# EAGLE design scoreboard (EAGLE 9.6.2)
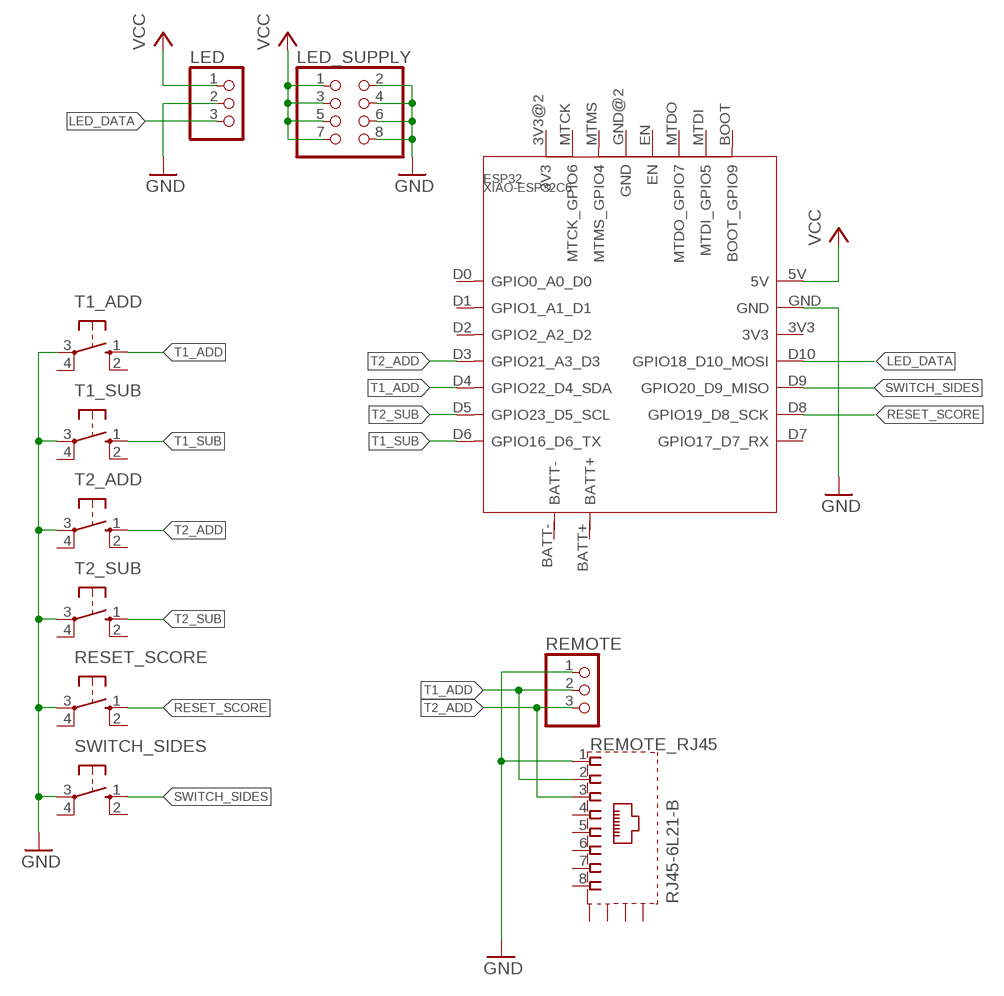
[diagram p0: schematic, sheet 1]

## Parts
ESP32  XIAO-ESP32C6  [XIAO-ESP32C6-MODULE14P-2.54-21X17.8MM]
LED  PINHD-1X3  [1X03]
LED_SUPPLY  PINHD-2X4  [2X04]
REMOTE  PINHD-1X3  [1X03]
REMOTE_RJ45  RJ45-6L21-B  [RJ45-SHIELD1]
RESET_SCORE  10-XX  [B3F-10XX]
SWITCH_SIDES  10-XX  [B3F-10XX]
T1_ADD  10-XX  [B3F-10XX]
T1_SUB  10-XX  [B3F-10XX]
T2_ADD  10-XX  [B3F-10XX]
T2_SUB  10-XX  [B3F-10XX]

## Nets
GND: ESP32.GND LED.2 LED_SUPPLY.2 LED_SUPPLY.4 LED_SUPPLY.6 LED_SUPPLY.8 REMOTE.1 REMOTE_RJ45.1 RESET_SCORE.3(P) SWITCH_SIDES.3(P) T1_ADD.3(P) T1_SUB.3(P) T2_ADD.3(P) T2_SUB.3(P)
LED_DATA: ESP32.D10(GPIO18_D10_MOSI) LED.3
RESET_SCORE: ESP32.D8(GPIO19_D8_SCK) RESET_SCORE.1(S)
SWITCH_SIDES: ESP32.D9(GPIO20_D9_MISO) SWITCH_SIDES.1(S)
T1_ADD: ESP32.D4(GPIO22_D4_SDA) REMOTE.2 REMOTE_RJ45.2 T1_ADD.1(S)
T1_SUB: ESP32.D6(GPIO16_D6_TX) T1_SUB.1(S)
T2_ADD: ESP32.D3(GPIO21_A3_D3) REMOTE.3 REMOTE_RJ45.3 T2_ADD.1(S)
T2_SUB: ESP32.D5(GPIO23_D5_SCL) T2_SUB.1(S)
VCC: ESP32.5V LED.1 LED_SUPPLY.1 LED_SUPPLY.3 LED_SUPPLY.5 LED_SUPPLY.7
Unconnected: ESP32.3V3 ESP32.3V3@2(3V3) ESP32.BATT+ ESP32.BATT- ESP32.BOOT(BOOT_GPIO9) ESP32.D0(GPIO0_A0_D0) ESP32.D1(GPIO1_A1_D1) ESP32.D2(GPIO2_A2_D2) ESP32.D7(GPIO17_D7_RX) ESP32.EN ESP32.GND@2(GND) ESP32.MTCK(MTCK_GPIO6) ESP32.MTDI(MTDI_GPIO5) ESP32.MTDO(MTDO_GPIO7) ESP32.MTMS(MTMS_GPIO4) REMOTE_RJ45.4 REMOTE_RJ45.5 REMOTE_RJ45.6 REMOTE_RJ45.7 REMOTE_RJ45.8 REMOTE_RJ45.S1(S) REMOTE_RJ45.S2(S) REMOTE_RJ45.S3(S) REMOTE_RJ45.S4(S) RESET_SCORE.2(S1) RESET_SCORE.4(P1) SWITCH_SIDES.2(S1) SWITCH_SIDES.4(P1) T1_ADD.2(S1) T1_ADD.4(P1) T1_SUB.2(S1) T1_SUB.4(P1) T2_ADD.2(S1) T2_ADD.4(P1) T2_SUB.2(S1) T2_SUB.4(P1)

## Library data of the parts
ESP32 = Seeed Studio XIAO Series:XIAO-ESP32C6
LED REMOTE = pinhead:PINHD-1X3: PIN HEADER
LED_SUPPLY = pinhead:PINHD-2X4: PIN HEADER
REMOTE_RJ45 = con-tycoelectronics:RJ45*2: RJ45 Low Profile Shield Type 2 For all RJ45 L, LC, LCT and X Series Models Source: www.tycoelectronics.com .. ENG_DS_1654001_1099_RJ_L_0507.pdf; OC_FARNELL: unknown; OC_NEWARK: unknown
RESET_SCORE SWITCH_SIDES T1_ADD T1_SUB T2_ADD T2_SUB = switch-omron:10-XX: OMRON SWITCH; MPN: B3F-1000; OC_FARNELL: 176432; OC_NEWARK: 36M3542

## Board
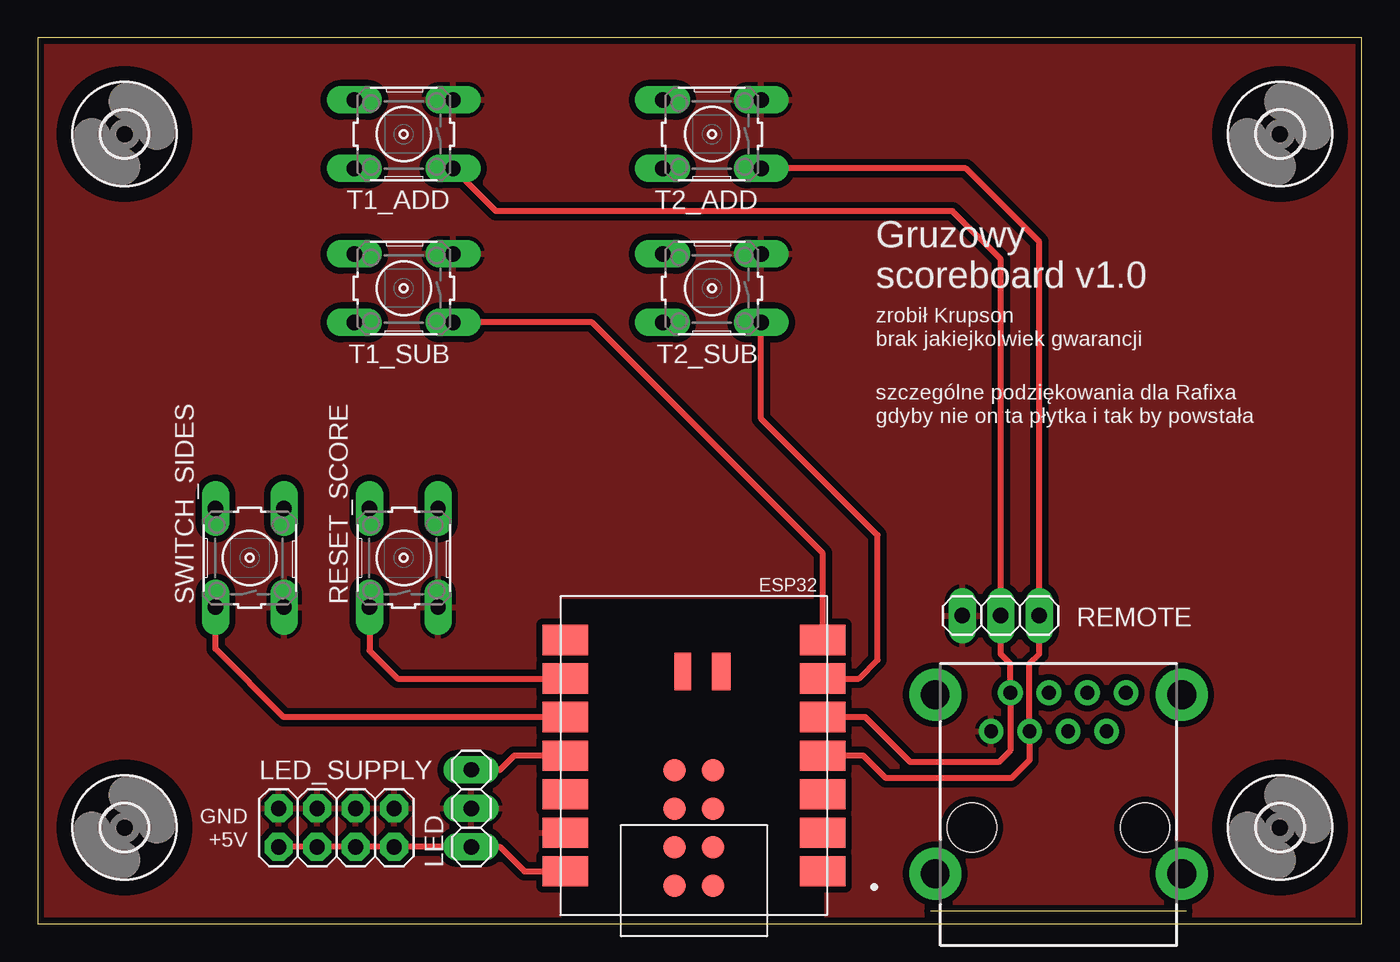
[diagram p1: board, top side]

Size 87.3 x 58.41 mm. Coordinates in mm from the lower left corner, seen from the top.
Outline: 0,0 87.3,0 87.3,58.41 0,58.41 0,0
Copper layers (1*16): Top 0.035mm / dielectric 1.6mm / Bottom 0.035mm
Design rules "jlcpcb-2layers": minimum track width 5mil, minimum drill 0.3mm, track to track 5mil, track to pad 5mil, pad to pad 5mil, via to via 5mil, smd to smd 5mil, copper to edge 0.2mm, drill to drill 6mil, minimum pad ring 10mil, minimum via ring 3mil, stop-mask expansion 4mil, vias tented up to drill 0mil, thermal gap 10mil

### Footprints (pad centres in the part's own frame; a part is rotated, then mirrored left to right if it is on the bottom)
XIAO-ESP32C6-MODULE14P-2.54-21X17.8MM = smd 3 x 2: 3V3 17.301,13.04; 5V 17.301,18.12; D0 0.301,18.12; D1 0.301,15.58; D2 0.301,13.04; D3 0.301,10.5; D4 0.301,7.96; D5 0.301,5.42; D6 0.301,2.88; D7 17.301,2.88; D8 17.301,5.42; D9 17.301,7.96; D10 17.301,10.5; GND 17.301,15.58 | smd 1.5 x 1.5: 3V3@2 7.531,11.46; BOOT 10.071,11.46; EN 10.071,16.54; GND@2 7.531,16.54; MTCK 7.531,14; MTDI 10.071,19.08; MTDO 7.531,19.08; MTMS 10.071,14 | smd 1.1 x 2.5: BATT+ 9.55,4.953 | smd 1.227 x 2.5: BATT- 7.01,4.953
1X03 = drill 1.016 long: 1 -2.54,0; 2 0,0; 3 2.54,0
2X04 = drill 1.016 octagon: 1 -3.81,-1.27; 2 -3.81,1.27; 3 -1.27,-1.27; 4 -1.27,1.27; 5 1.27,-1.27; 6 1.27,1.27; 7 3.81,-1.27; 8 3.81,1.27
RJ45-SHIELD1 = drill 0.9 pad 1.4: 1 -4.445,6.35; 2 -3.175,8.89; 3 -1.905,6.35; 4 -0.635,8.89; 5 0.635,6.35; 6 1.905,8.89; 7 3.175,6.35; 8 4.445,8.89 | drill 1.9 pad 2.5: S1 -8.128,-3.048; S2 8.128,-3.048; S3 -8.128,8.76; S4 8.128,8.76 | hole 3.251: -5.715,0; 5.715,0
B3F-10XX = drill 1.016 long: 1 -3.251,2.261; 2 3.251,2.261; 3 -3.251,-2.261; 4 3.251,-2.261
3,0 = hole 3: 0,0

### Placement (x,y rotation side)
ESP32  52.07,21.59 180 top
LED  28.57,7.62 90 top
LED_SUPPLY  19.68,6.35 0 top
REMOTE  63.5,20.32 0 top
REMOTE_RJ45  67.31,6.35 0 top
RESET_SCORE  24.13,24.13 90 top
SWITCH_SIDES  13.97,24.13 90 top
T1_ADD  24.13,52.07 180 top
T1_SUB  24.13,41.91 180 top
T2_ADD  44.45,52.07 180 top
T2_SUB  44.45,41.91 180 top
U$1  [3,0]  5.71,52.07 0 top
U$2  [3,0]  81.92,6.35 0 top
U$3  [3,0]  81.92,52.07 0 top
U$4  [3,0]  5.71,6.35 0 top

### Tracks (layer width: path | path; a pad name or v marks a point on that pad's centre or on a via)
GND
  pour Top (isolate 0.406): 0,0 0,58.42 87.63,58.42 87.63,0 52.07,0 52.07,21.59 34.29,21.59 34.29,0
LED_DATA
  Top 0.406: ESP32.D10 31.41,11.09 30.48,10.16 LED.3
RESET_SCORE
  Top 0.406: RESET_SCORE.1 21.87,18.01 23.71,16.17 ESP32.D8
SWITCH_SIDES
  Top 0.406: ESP32.D9 16.21,13.63 11.71,18.14 SWITCH_SIDES.1
T1_ADD
  Top 0.406: T1_ADD.1 30.2,46.99 60.33,46.99 63.5,43.81 REMOTE.2 63.5,17.78 64.14,17.14 REMOTE_RJ45.2 64.14,11.43 63.37,10.67 57.53,10.67 54.57,13.63 ESP32.D4
T1_SUB
  Top 0.406: ESP32.D6 51.77,24.43 36.55,39.65 T1_SUB.1
T2_ADD
  Top 0.406: T2_ADD.1 61.19,49.81 66.04,44.96 REMOTE.3 66.04,17.78 65.41,17.14 REMOTE_RJ45.3 65.41,10.79 64.21,9.6 55.93,9.6 54.44,11.09 ESP32.D3
T2_SUB
  Top 0.406: ESP32.D5 54.14,16.17 55.37,17.4 55.37,25.63 47.7,33.3 T2_SUB.1
VCC
  Top 0.406: ESP32.5V 32.09,3.47 30.48,5.08 LED.1 LED_SUPPLY.7 LED_SUPPLY.5 LED_SUPPLY.3 LED_SUPPLY.1

### Text on the board
tNames: Gruzowy / scoreboard v1.0 | zrobił Krupson / brak jakiejkolwiek gwarancji | szczególne podziękowania dla Rafixa / gdyby nie on ta płytka i tak by powstała | GND / +5V
Measures: GND | T1A | T2A